# Altium schematic sheet MAX14830ETM+.SchDoc
size Letter
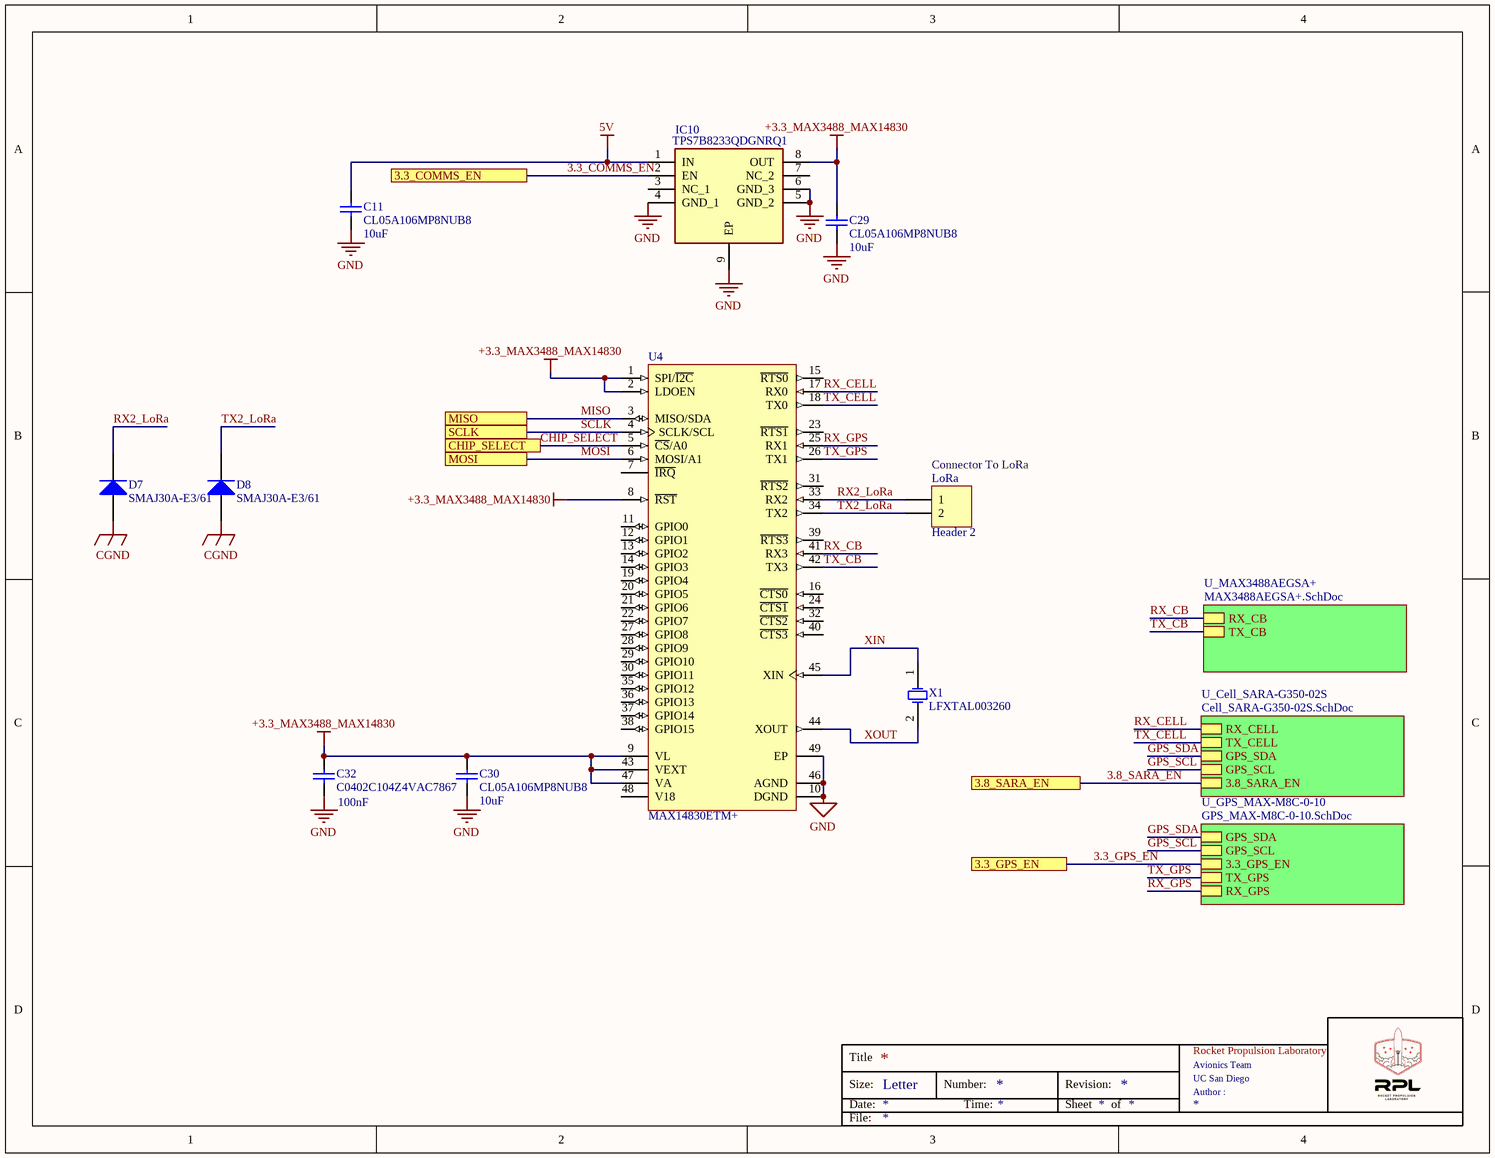
[diagram p0: MAX14830ETM+.SchDoc]

## Parts
C11  CL05A106MP8NUB8  value 10uF  [0402]
C29  CL05A106MP8NUB8  value 10uF  [0402]
C30  CL05A106MP8NUB8  value 10uF  [0402]
C32  C0402C104Z4VAC7867  Spec: 100nF  [CAPC1005X60X30LL05T10]
D7  SMAJ30A-E3/61  [VISH-DO-214AC-2_N]
D8  SMAJ30A-E3/61  [VISH-DO-214AC-2_N]
IC10  TPS7B8233QDGNRQ1  [SOP65P490X110-9N]
LoRa  Header 2  [HDR1X2]
U4  MAX14830ETM+  [T4877+3_M]
X1  LFXTAL003260  [ABRA-ABLS2-2_V]

## Sub-sheets
U_Cell_SARA-G350-02S = Cell_SARA-G350-02S.SchDoc: RX_CELL, TX_CELL, GPS_SDA, GPS_SCL, 3.8_SARA_EN
U_GPS_MAX-M8C-0-10 = GPS_MAX-M8C-0-10.SchDoc: GPS_SDA, GPS_SCL, 3.3_GPS_EN, TX_GPS, RX_GPS
U_MAX3488AEGSA+ = MAX3488AEGSA+.SchDoc: RX_CB, TX_CB

## Ports
3.3_COMMS_EN, 3.3_GPS_EN, 3.8_SARA_EN, CHIP_SELECT, MISO, MOSI, SCLK

## Nets
5V: C11.2 IC10.1(IN)
+3.3_MAX3488_MAX14830: C29.2 C30.2 C32.2 IC10.8(OUT) U4.1(SPI/~{I2C}) U4.2(LDOEN) U4.8(~{RST}) U4.9(VL) U4.43(VEXT) U4.47(VA)
CGND: D7.2(A) D8.2(A)
GND: C11.1 C29.1 C30.1 C32.1 IC10.4(GND_1) IC10.5(GND_2) IC10.6(GND_3) IC10.9(EP) U4.10(DGND) U4.46(AGND) U4.49(EP)
3.3_COMMS_EN: IC10.2(EN) ; port 3.3_COMMS_EN
3.3_GPS_EN: port 3.3_GPS_EN, sheet U_GPS_MAX-M8C-0-10/3.3_GPS_EN
3.8_SARA_EN: port 3.8_SARA_EN, sheet U_Cell_SARA-G350-02S/3.8_SARA_EN
CHIP_SELECT: U4.5(~{CS}/A0) ; port CHIP_SELECT
GPS_SCL: sheet U_Cell_SARA-G350-02S/GPS_SCL, sheet U_GPS_MAX-M8C-0-10/GPS_SCL
GPS_SDA: sheet U_Cell_SARA-G350-02S/GPS_SDA, sheet U_GPS_MAX-M8C-0-10/GPS_SDA
MISO: U4.3(MISO/SDA) ; port MISO
MOSI: U4.6(MOSI/A1) ; port MOSI
RX2_LoRa: D7.1(K) LoRa.1 U4.33(RX2)
RX_CB: U4.41(RX3) ; sheet U_MAX3488AEGSA+/RX_CB
RX_CELL: U4.17(RX0) ; sheet U_Cell_SARA-G350-02S/RX_CELL
RX_GPS: U4.25(RX1) ; sheet U_GPS_MAX-M8C-0-10/RX_GPS
SCLK: U4.4(SCLK/SCL) ; port SCLK
TX2_LoRa: D8.1(K) LoRa.2 U4.34(TX2)
TX_CB: U4.42(TX3) ; sheet U_MAX3488AEGSA+/TX_CB
TX_CELL: U4.18(TX0) ; sheet U_Cell_SARA-G350-02S/TX_CELL
TX_GPS: U4.26(TX1) ; sheet U_GPS_MAX-M8C-0-10/TX_GPS
XIN: U4.45(XIN) X1.1(X1)
XOUT: U4.44(XOUT) X1.2(X2)

Not connected (* = marked no-connect by the designer): IC10 3(NC_1) 7(NC_2); U4 7(~{IRQ}) 11(GPIO0) 12(GPIO1) 13(GPIO2) 14(GPIO3) 15(~{RTS0}) 16(~{CTS0}) 19(GPIO4) 20(GPIO5) 21(GPIO6) 22(GPIO7) 23(~{RTS1}) 24(~{CTS1}) 27(GPIO8) 28(GPIO9) 29(GPIO10) 30(GPIO11) 31(~{RTS2}) 32(~{CTS2}) 35(GPIO12) 36(GPIO13) 37(GPIO14) 38(GPIO15) 39(~{RTS3}) 40(~{CTS3}) 48(V18)

## Notes on the sheet
- (near LoRa) Connector To LoRa
- Title
- Size:
- Date:
- Letter
- Number:
- Time:
- Revision:
- Sheet
- of
- Rocket Propulsion Laboratory
- UC San Diego
- Avionics Team
- Author :
- File:

## Library data of the parts
C11 C29 C30 = Cap: Capacitor; Published: 8-Jun-2000; LatestRevisionDate: 17-Jul-2002; LatestRevisionNote: Re-released for DXP Platform.; PackageReference: RAD-0.3; Publisher: Altium Limited; PackageDescription: Radial Cap, Thru-Hole; 2 Leads; 0.3 in Pin Spacing
C32 = CMP-2008-02369-1: Manufacturer: Kemet; Part Number: C0402C104Z4VAC7867
D7 D8 = CMP-0548-00228-2: Transient Voltage Suppressor, 6.40 to 231 V, 30 V Stand-off Voltage, Uni-Directional, -55 to 155 degC, 2-pin DO-214AC, Pb-Free, Tape and Reel; Manufacturer: Vishay Semiconductor; ID (uA): 1; VWM (V): 30; IFSM: 40 A; PPPM (W): 400, 300; VBR Uni-Directional (V): 6.4 to 231; Mounting Technology: Surface Mount; Packing: Tape and Reel; ComponentLink1URL: http://www.vishay.com/; ComponentLink3URL: http://www.vishay.com/docs/88390/smaj50a.pdf; DatasheetVersion: 12/8/2013; RoHS: TRUE; PartNumber: SMAJ30A-E3/61; PackageReference: DO-214AC-2; ComponentLink2URL: http://www.vishay.com/docs/88390/smaj50a.pdf; ComponentLink1Description: Manufacturer URL; Operating Junction and Storage Temperature Range: -55 to 150 degC; PackageDescription: 2-Pin DO-214AC (SMA), Body 4.245 x 2.665 mm; ComponentLink3Description: Package Specification; ComponentLink2Description: Datasheet
IC10 = TPS7B8233QDGNRQ1: Integrated Circuit; Manufacturer_Name: Texas Instruments; Datasheet Link: http://www.ti.com/lit/gpn/tps7b82-q1; Height: 1.1mm; Manufacturer_Part_Number: TPS7B8233QDGNRQ1; Arrow Part Number: TPS7B8233QDGNRQ1; Arrow Price/Stock: https://www.arrow.com/en/products/tps7b8233qdgnrq1/texas-instruments; Mouser Part Number: 595-TPS7B8233QDGNRQ1; Mouser Price/Stock: https://www.mouser.co.uk/ProductDetail/Texas-Instruments/TPS7B8233QDGNRQ1?qs=gTYE2QTfZfTgserf%2FHg6KA%3D%3D
LoRa = Header 2: Header, 2-Pin; LatestRevisionDate: 17-Jul-2002; LatestRevisionNote: Re-released for DXP Platform.; Publisher: Altium Limited
U4 = CMP-0250-00007-1: Quad Serial UART with 128-Word FIFO, 48-Pin TQFN, -40°C to +85°C, Pb-Free; ComponentLink3URL: http://pdfserv.maxim-ic.com/package_dwgs/21-0144.PDF; ComponentLink2Description: Datasheet; ComponentLink1URL: http://www.maxim-ic.com; ComponentLink3Description: Package Specification; PackageVersion: revI, 2009; DatasheetVersion: Rev 2, Sep-2011; ComponentLink1Description: Manufacturer URL; PackageReference: T4877+3; ComponentLink2URL: http://datasheets.maxim-ic.com/en/ds/MAX14830.pdf; PackageDescription: 48-Pin Thin Quad Flatpack, No Leads, 7 x 7 x 0.75 mm Body, 0.5 mm Pitch, TQFN, Pb-Free
X1 = CMP-0277-00002-1: Low Profile Surface Mount Microprocessor Crystal, 4.096 MHz +/-30 ppm, 180 Ohm, -40 to 85 degC, 2-Pin 11.4 x 4.7 x 3.3 mm SMD, RoHS, Tape and Reel; Manufacturer: Abracon; PartNumber: ABLS2-4.096MHZ-D4Y-T; Operation Mode: Fundamental or 3rd Overtone; Shunt Capacitance: 7 pF Max.; ESR: 180 Ohm; Load Capacitance: 18 pF; Mounting Technology: Surface Mount; PackageDescription: 2-Pin SMD, Body 11.4 x 4.7 mm, Height 3.3 mm; ComponentLink1URL: http://www.abracon.com/; Freq. Stability: +/- 30 ppm; ComponentLink2Description: Datasheet; Operating Temp. Range: -40 to 85 degC; Packing: Tape and Reel; RoHS: TRUE; PackageReference: ABLS2-2; DatasheetVersion: Rev. 03.31.11; Freq. Tolerance: +/- 30 ppm; Frequency: 4.096 MHz; ComponentLink2URL: http://www.abracon.com/Resonators/ABLS2.pdf; ComponentLink1Description: Manufacturer URL